# EasyEDA Pro project PCB.eprj, schematic ALU
Board Name: ALU; Create Date: 2025-08-12; Page Name: P1; Project Name: PCB; Schematic Name: ALU; Update Date: 2025-08-12; Company: EasyEDA.com; Page Size: A4; Version: V1.0
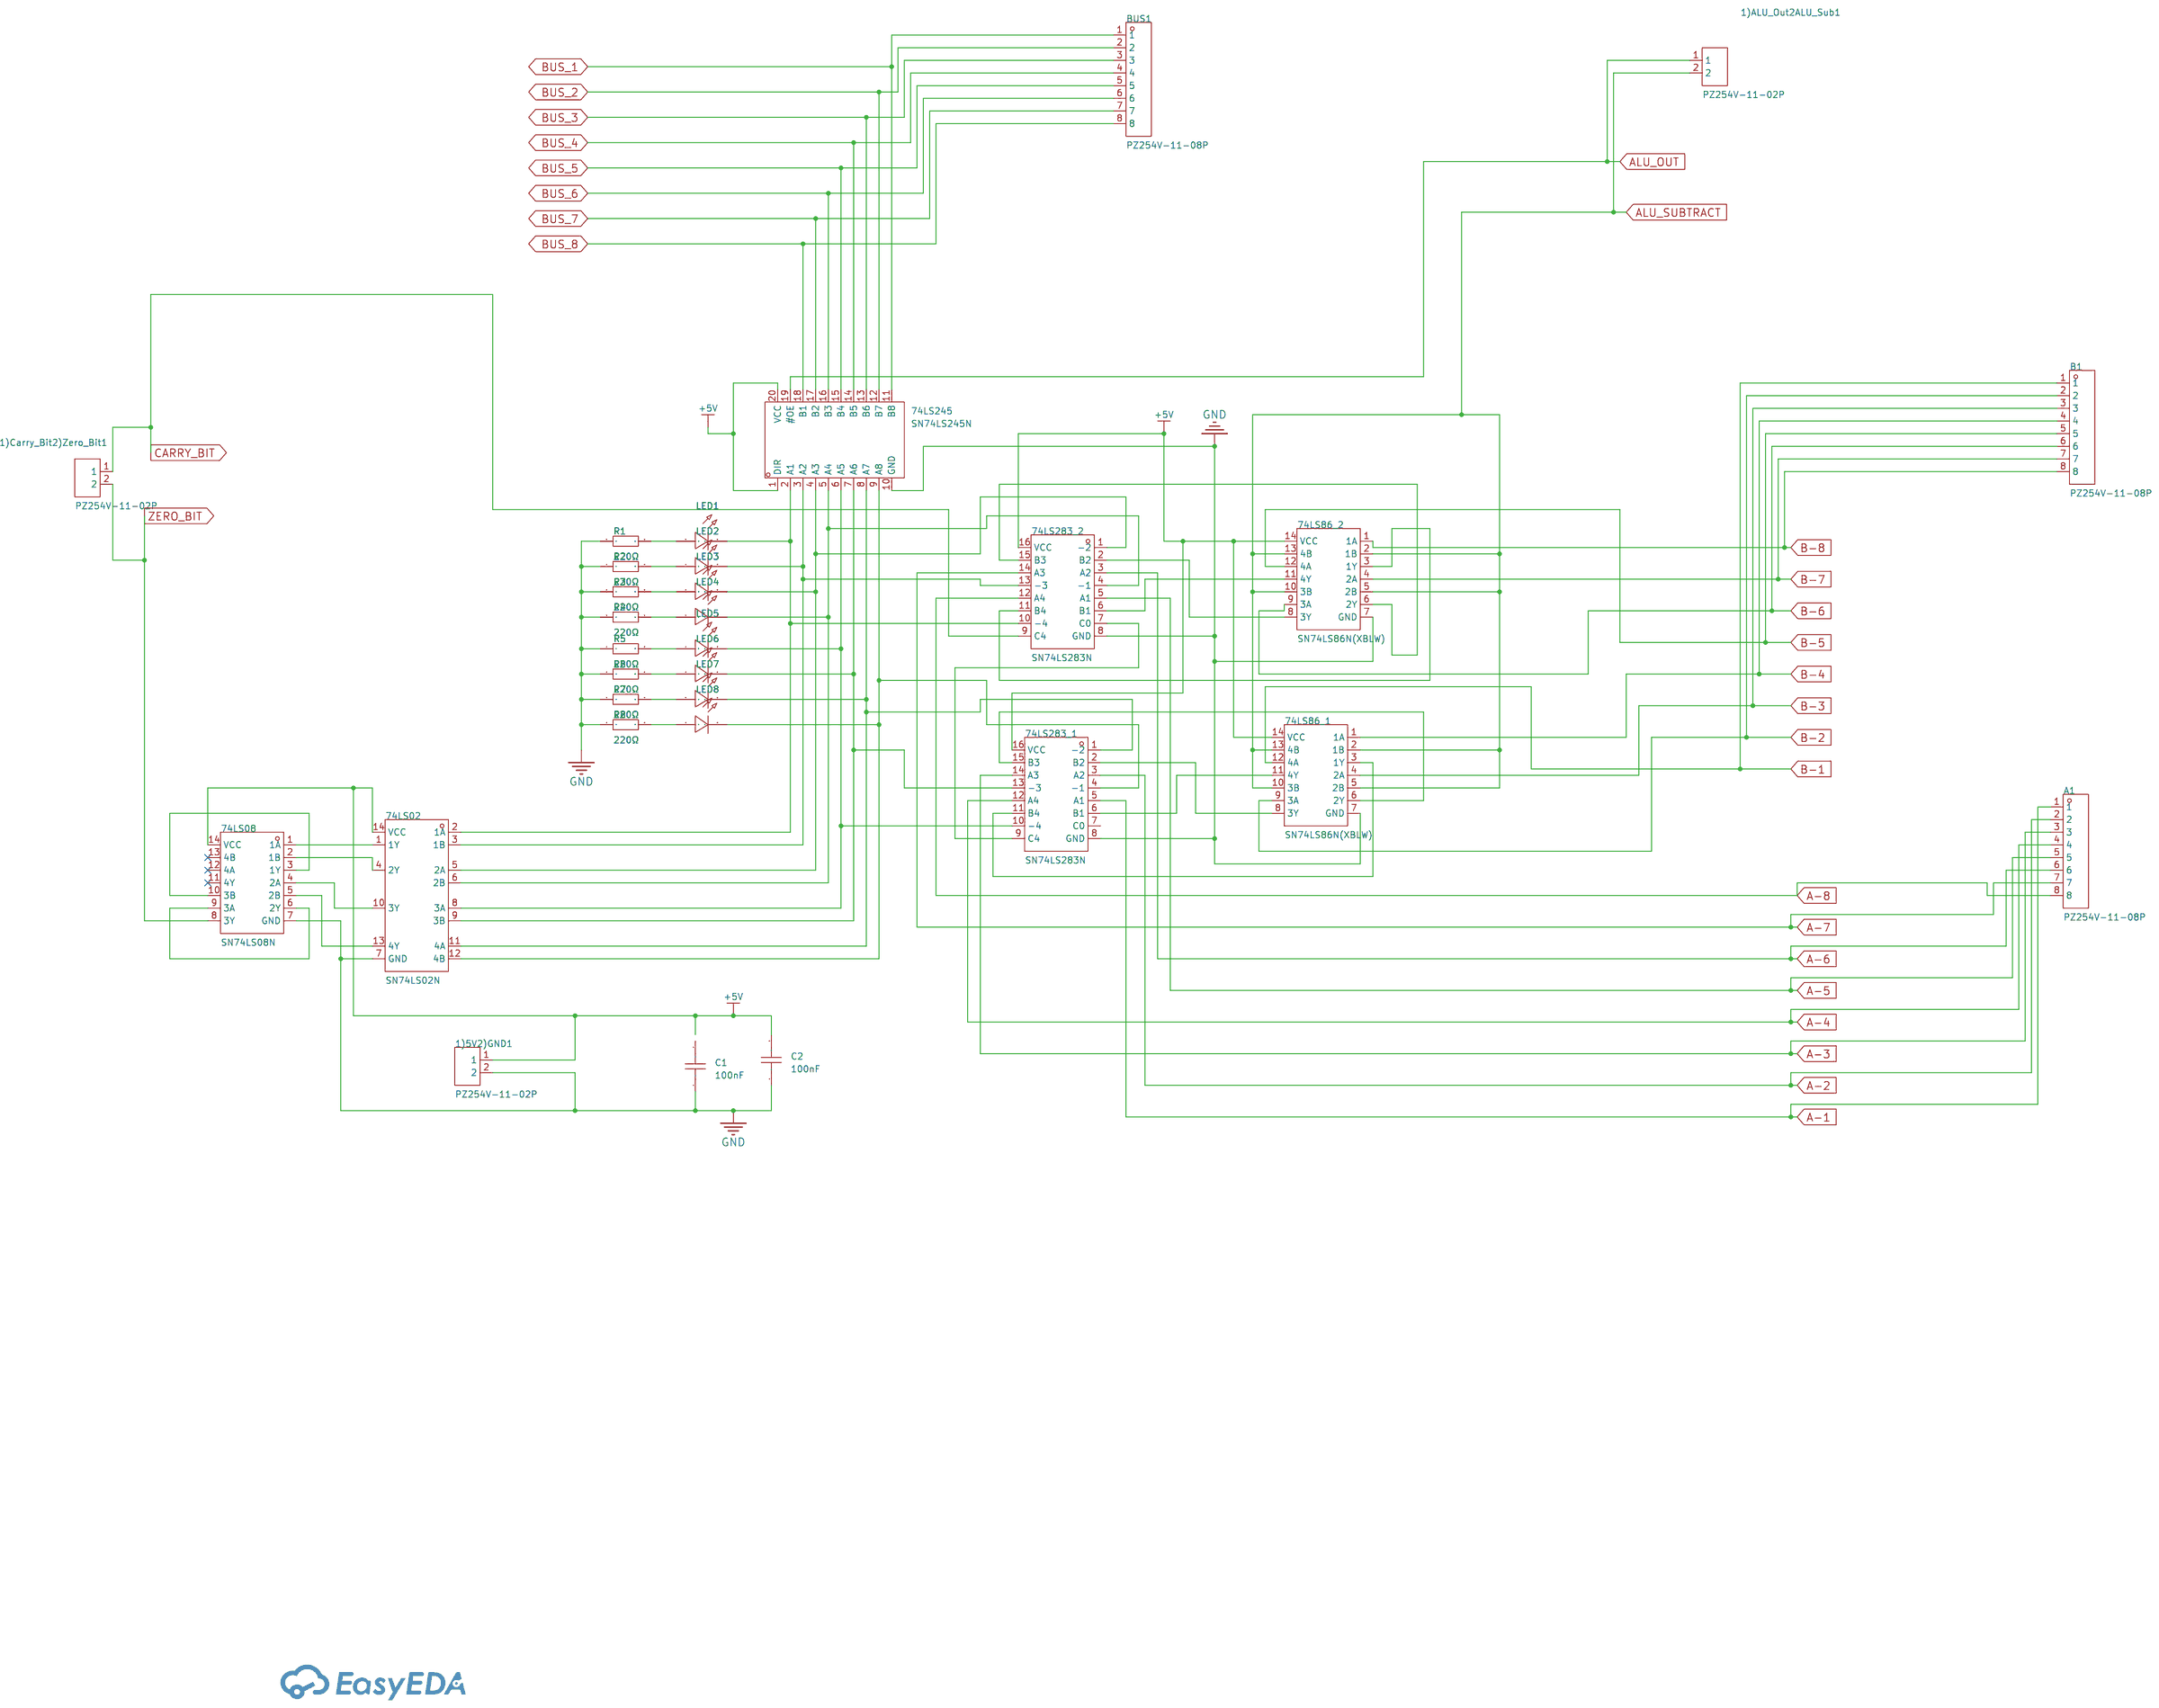
[diagram p5: schematic sheet]

## Parts
1)5V2)GND1  PZ254V-11-02P  [HDR-TH_2P-P2.54-V-M]
1)ALU_Out2ALU_Sub1  PZ254V-11-02P  [HDR-TH_2P-P2.54-V-M]
1)Carry_Bit2)Zero_Bit1  PZ254V-11-02P  [HDR-TH_2P-P2.54-V-M]
74LS02  SN74LS02N  [PDIP-14_L19.3-W6.4-P2.54-LS7.6-BL]
74LS08  SN74LS08N  [PDIP-14_L19.3-W6.4-P2.54-LS7.9-BL-1]
74LS86_1  SN74LS86N(XBLW)  [DIP-14_L19.0-W6.4-P2.54-LS7.6-BL]
74LS86_2  SN74LS86N(XBLW)  [DIP-14_L19.0-W6.4-P2.54-LS7.6-BL]
74LS245  SN74LS245N  [DIP-20_L25.5-W10.0-P2.54-LS7.6-BL]
74LS283_1  SN74LS283N  [PDIP-16_L19.3-W6.4-P2.54-LS7.94-BL]
74LS283_2  SN74LS283N  [PDIP-16_L19.3-W6.4-P2.54-LS7.94-BL]
A1  PZ254V-11-08P  [HDR-TH_8P-P2.54-V-M]
B1  PZ254V-11-08P  [HDR-TH_8P-P2.54-V-M]
BUS1  PZ254V-11-08P  [HDR-TH_8P-P2.54-V-M]
C1  100nF  [CAP-TH_L8.5-W5.0-P5.00-D1.2]
C2  100nF  [CAP-TH_L8.5-W5.0-P5.00-D1.2]
LED1  -  [LED-TH_BD5.8-P2.54-FD]
LED2  -  [LED-TH_BD5.8-P2.54-FD]
LED3  -  [LED-TH_BD5.8-P2.54-FD]
LED4  -  [LED-TH_BD5.8-P2.54-FD]
LED5  -  [LED-TH_BD5.8-P2.54-FD]
LED6  -  [LED-TH_BD5.8-P2.54-FD]
LED7  -  [LED-TH_BD5.8-P2.54-FD]
LED8  -  [LED-TH_BD5.8-P2.54-FD]
R1  220Ω  [R_AXIAL-0.4]
R2  220Ω  [R_AXIAL-0.4]
R3  220Ω  [R_AXIAL-0.4]
R4  220Ω  [R_AXIAL-0.4]
R5  220Ω  [R_AXIAL-0.4]
R6  220Ω  [R_AXIAL-0.4]
R7  220Ω  [R_AXIAL-0.4]
R8  220Ω  [R_AXIAL-0.4]

## Library data of the parts
1)5V2)GND1 1)ALU_Out2ALU_Sub1 1)Carry_Bit2)Zero_Bit1 = PZ254V-11-02P: LCSC Part Name: 1x2P 间距:2.54mm 方针 直插; Supplier Part: C492401; Manufacturer: XFCN(兴飞); Supplier Footprint: 插件,P=2.54mm; JLCPCB Part Class: Extended Part; Datasheet: https://atta.szlcsc.com/upload/public/pdf/source/20200309/C492401_A812433581A9B211A7FFA413ADDFF0E5.pdf; Supplier: LCSC; Pin Structure: 1x2P; Pitch: 2.54mm; Circluar Pins/Square Pins: Policy; Mounting Type: Straight; Number of Rows: Single Row; Number of Pins: 2P; Length of Mating Pin: 6mm; Insulation Height: 2.5mm; Length of End Connection Pin: 3mm; Contact Material: Brass; Operating Temperature: -40℃~+105℃; Color: Black
74LS02 = SN74LS02N: Logic Gate Type:NORGate Number of Channels:4 Supply Voltage:4.75V~5.25V Supply Voltage:4.75V~5.25V Sink Current:16mA Source Current:400uA High Level Range (VIH):2V High Level Range (VIH):2V Low Level Range (VIL):800mV Low Level Range (VIL):800mV Series:74; Supplier Part: C273654; Manufacturer: TI(德州仪器); Supplier Footprint: PDIP-14; JLCPCB Part Class: Extended Part; Datasheet: https://www.ti.com/cn/lit/gpn/sn74ls02; Supplier: LCSC; Logic Gate Type: NORGate; Number of Channels: 4; Supply Voltage: 4.75V~5.25V; Sink Current: 16mA; Source Current: 400uA; High Level Range (VIH): 2V; Low Level Range (VIL): 800mV; Series: 74LSSeries; Propagation Delay Time: 15ns@5V,15pF; Operating Temperature: 0℃~+70℃
74LS08 = SN74LS08N: Supplier Part: C2869595; Manufacturer: TI(德州仪器); Supplier Footprint: PDIP-14; JLCPCB Part Class: Extended Part; Datasheet: https://www.ti.com/cn/lit/gpn/sn54s08; Supplier: LCSC; Logic Type: AND Gate; Number of Channels: 4; Voltage - Supply: 4.75V~5.25V; Current - Output Low(IOL): 8mA; Current - Output High(IOH): 400uA; Input Logic Level - High: 2V; Input Logic Level - Low: 800mV; Series: 74LSSeries; Operating Temperature: 0℃~+70℃
74LS86_1 74LS86_2 = SN74LS86N(XBLW): Logic Type:XOR Gate Number of Channels:4 Voltage - Supply:2V~6V Voltage - Supply:2V~6V Quiescent Current:2uA Current - Output Low(IOL):5.2mA Current - Output High(IOH):5.2mA Input Logic Level - High:1.2V~3.2V Input Logic Level - High:1.2V~3.2V Input Logic; Supplier Part: C42415784; Manufacturer: XBLW(芯伯乐); Supplier Footprint: DIP-14; Datasheet: https://atta.szlcsc.com/upload/public/pdf/source/20241217/4BD867E8FF5FB27D45A6321784BC3EB1.pdf; Supplier: LCSC; Logic Type: XOR Gate; Number of Channels: 4; Voltage - Supply: 2V~6V; Quiescent Current: 2uA; Current - Output Low(IOL): 5.2mA; Current - Output High(IOH): 5.2mA; Input Logic Level - High: 1.2V~3.2V; Input Logic Level - Low: 800mV~2.8V; Output Logic Level - High: 2V~5.81V
74LS245 = SN74LS245N: output type:Tri-State Voltage - Supply:4.75V~5.25V Voltage - Supply:4.75V~5.25V Number of Elements:1 Number of Bits per Element:8 Current - Output Low(IOL):24mA Current - Output High(IOH):15mA Logic Family:74LS Operating Temperature:0℃~+70℃ Operating Temp; Supplier Part: C352966; Manufacturer: TI(德州仪器); Supplier Footprint: DIP-20; JLCPCB Part Class: Extended Part; Datasheet: https://www.ti.com/cn/lit/gpn/sn74ls245; Supplier: LCSC; output type: Tri-State; Voltage - Supply: 4.75V~5.25V; Number of Elements: 1; Number of Bits per Element: 8; Current - Output Low(IOL): 24mA; Current - Output High(IOH): 15mA; Logic Family: 74LS; Operating Temperature: 0℃~+70℃
74LS283_1 74LS283_2 = SN74LS283N: LCSC Part Name: 二进制全加器; Supplier Part: C1523494; Manufacturer: TI(德州仪器); Supplier Footprint: PDIP-16; JLCPCB Part Class: Extended Part; Datasheet: https://www.ti.com/cn/lit/gpn/sn74ls283; Supplier: LCSC
A1 B1 BUS1 = PZ254V-11-08P: LCSC Part Name: 间距:2.54mm 1x8P 直插 方针; Supplier Part: C492407; Manufacturer: XFCN(兴飞); Supplier Footprint: 插件,P=2.54mm; JLCPCB Part Class: Extended Part; Datasheet: https://atta.szlcsc.com/upload/public/pdf/source/20200309/C492407_83A6FB26A2233368EDB9516968EC6149.pdf; Supplier: LCSC; Pin Structure: 1x8P; Pitch: 2.54mm; Circluar Pins/Square Pins: Square Pins; Mounting Type: Straight; Number of Rows: Plugin; Number of Pins: 8P; Length of Mating Pin: 6mm; Insulation Height: 2.5mm; Length of End Connection Pin: 3mm; Operating Temperature Range: -40℃~+105℃; Color: Black
C1 C2 = CT4-0805B104K500F3: LCSC Part Name: 100nF ±10% 50V C3型（直脚）; Supplier Part: C84772; Manufacturer: FH(风华); Supplier Footprint: 插件,P=5.08mm; JLCPCB Part Class: Extended Part; Datasheet: https://atta.szlcsc.com/upload/public/pdf/source/20190402/C385200_059806A6312B28FF1421A2413EB641E1.pdf; Supplier: LCSC; Tolerance: ±10%
LED1-LED8 = LED_TH-R_5mm: Supplier Footprint: Through
R1-R8 = Res_AXIAL-1/4W: Supplier Footprint: Through

## Nets
+5V: 1)5V2)GND1.1 74LS02.14(VCC) 74LS08.14(VCC) 74LS86_1.14(VCC) 74LS86_2.14(VCC) 74LS245.1(DIR) 74LS245.20(VCC) 74LS283_1.16(VCC) 74LS283_2.16(VCC) C2.2
GND: 1)5V2)GND1.2 74LS02.7(GND) 74LS08.7(GND) 74LS86_1.7(GND) 74LS86_2.7(GND) 74LS245.10(GND) 74LS283_1.8(GND) 74LS283_2.8(GND) C1.1 C2.1 R1.1 R2.1 R3.1 R4.1 R5.1 R6.1 R7.1 R8.1
A-1: 74LS283_1.5(A1) A1.1
A-2: 74LS283_1.3(A2) A1.2
A-3: 74LS283_1.14(A3) A1.3
A-4: 74LS283_1.12(A4) A1.4
A-5: 74LS283_2.5(A1) A1.5
A-6: 74LS283_2.3(A2) A1.6
A-7: 74LS283_2.14(A3) A1.7
A-8: 74LS283_2.12(A4) A1.8
ALU_OUT: 1)ALU_Out2ALU_Sub1.1 74LS245.19(#OE)
ALU_SUBTRACT: 1)ALU_Out2ALU_Sub1.2 74LS86_1.2(1B) 74LS86_1.5(2B) 74LS86_1.10(3B) 74LS86_1.13(4B) 74LS86_2.2(1B) 74LS86_2.5(2B) 74LS86_2.10(3B) 74LS86_2.13(4B)
B-1: 74LS86_1.12(4A) B1.1
B-2: 74LS86_1.9(3A) B1.2
B-3: 74LS86_1.4(2A) B1.3
B-4: 74LS86_1.1(1A) B1.4
B-5: 74LS86_2.12(4A) B1.5
B-6: 74LS86_2.9(3A) B1.6
B-7: 74LS86_2.4(2A) B1.7
B-8: 74LS86_2.1(1A) B1.8
BUS_1: 74LS245.11(B8) BUS1.1
BUS_2: 74LS245.12(B7) BUS1.2
BUS_3: 74LS245.13(B6) BUS1.3
BUS_4: 74LS245.14(B5) BUS1.4
BUS_5: 74LS245.15(B4) BUS1.5
BUS_6: 74LS245.16(B3) BUS1.6
BUS_7: 74LS245.17(B2) BUS1.7
BUS_8: 74LS245.18(B1) BUS1.8
CARRY_BIT: 1)Carry_Bit2)Zero_Bit1.1 74LS283_2.9(C4)
ZERO_BIT: 1)Carry_Bit2)Zero_Bit1.2 74LS08.8(3Y)
Net-(74LS02-1): 74LS02.1(1Y) 74LS08.1(1A)
Net-(74LS02-2): 74LS02.2(1A) 74LS245.2(A1) 74LS283_2.10(-4) LED1.2(A)
Net-(74LS02-3): 74LS02.3(1B) 74LS245.3(A2) 74LS283_2.13(-3) LED2.2(A)
Net-(74LS02-4): 74LS02.4(2Y) 74LS08.2(1B)
Net-(74LS02-5): 74LS02.5(2A) 74LS245.4(A3) 74LS283_2.1(-2) LED3.2(A)
Net-(74LS02-6): 74LS02.6(2B) 74LS245.5(A4) 74LS283_2.4(-1) LED4.2(A)
Net-(74LS02-8): 74LS02.8(3A) 74LS245.6(A5) 74LS283_1.10(-4) LED5.2(A)
Net-(74LS02-9): 74LS02.9(3B) 74LS245.7(A6) 74LS283_1.13(-3) LED6.2(A)
Net-(74LS02-10): 74LS02.10(3Y) 74LS08.4(2A)
Net-(74LS02-11): 74LS02.11(4A) 74LS245.8(A7) 74LS283_1.1(-2) LED7.2(A)
Net-(74LS02-12): 74LS02.12(4B) 74LS245.9(A8) 74LS283_1.4(-1) LED8.2(A)
Net-(74LS02-13): 74LS02.13(4Y) 74LS08.5(2B)
Net-(74LS08-3): 74LS08.3(1Y) 74LS08.10(3B)
Net-(74LS08-6): 74LS08.6(2Y) 74LS08.9(3A)
Net-(74LS86_1-3): 74LS86_1.3(1Y) 74LS283_1.11(B4)
Net-(74LS86_1-6): 74LS86_1.6(2Y) 74LS283_1.15(B3)
Net-(74LS86_1-8): 74LS86_1.8(3Y) 74LS283_1.2(B2)
Net-(74LS86_1-11): 74LS86_1.11(4Y) 74LS283_1.6(B1)
Net-(74LS86_2-3): 74LS86_2.3(1Y) 74LS283_2.11(B4)
Net-(74LS86_2-6): 74LS86_2.6(2Y) 74LS283_2.15(B3)
Net-(74LS86_2-8): 74LS86_2.8(3Y) 74LS283_2.2(B2)
Net-(74LS86_2-11): 74LS86_2.11(4Y) 74LS283_2.6(B1)
Net-(74LS283_1-9): 74LS283_1.9(C4) 74LS283_2.7(C0)
Net-(LED1-1): LED1.1(C) R1.2
Net-(LED2-1): LED2.1(C) R2.2
Net-(LED3-1): LED3.1(C) R3.2
Net-(LED4-1): LED4.1(C) R4.2
Net-(LED5-1): LED5.1(C) R5.2
Net-(LED6-1): LED6.1(C) R6.2
Net-(LED7-1): LED7.1(C) R7.2
Net-(LED8-1): LED8.1(C) R8.2

Not connected (* = marked no-connect by the designer): 74LS08 11(4Y)* 12(4A)* 13(4B)*; 74LS283_1 7(C0); C1 2
